# EAGLE design ATTiny2312_ISPProgrammer (EAGLE 6.4)
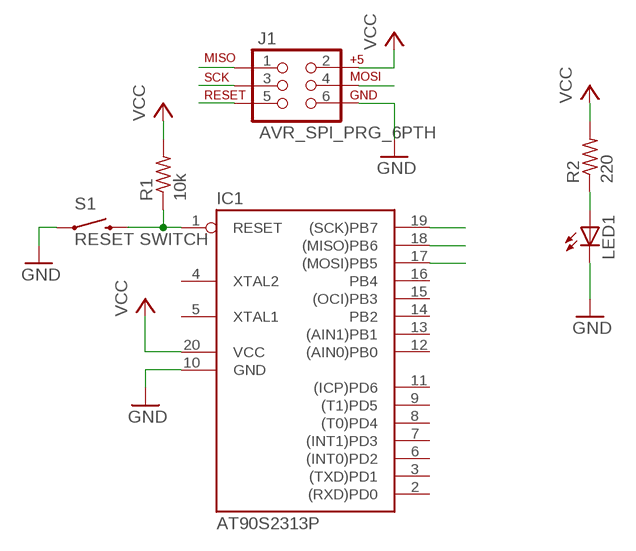
[diagram p0: schematic, sheet 1]

## Parts
IC1  AT90S2313P  [DIL20]
J1  AVR_SPI_PRG_6PTH  [2X3]
LED1  LED-3MM-NO_SILK  [LED3MM-NS]
R1  10k  R-US_0207/10  [0207/10]
R2  220  R-US_0207/10  [0207/10]
S1  RESET SWITCH  SWITCH-MOMENTARY-2PTH  [TACTILE-PTH]

## Nets
GND: IC1.10(GND) J1.6 LED1.K(C) S1.1
MISO: IC1.18((MISO)PB6) J1.1
MOSI: IC1.17((MOSI)PB5) J1.4
N$1: LED1.A R2.1
RST: IC1.1(RESET) J1.5 R1.1 S1.3
SCK: IC1.19((SCK)PB7) J1.3
VCC: IC1.20(VCC) J1.2 R1.2 R2.2
Unconnected: IC1.2((RXD)PD0) IC1.3((TXD)PD1) IC1.4(XTAL2) IC1.5(XTAL1) IC1.6((INT0)PD2) IC1.7((INT1)PD3) IC1.8((T0)PD4) IC1.9((T1)PD5) IC1.11((ICP)PD6) IC1.12((AIN0)PB0) IC1.13((AIN1)PB1) IC1.14(PB2) IC1.15((OCI)PB3) IC1.16(PB4)

## Library data of the parts
IC1 = atmel:AT90S2313: MICROCONTROLLER 2 Kbytes FLASH 128 bytes SRAM 128 bytes EEPROM UART; OC_FARNELL: unknown; OC_NEWARK: unknown
J1 = SparkFun-Connectors:AVR_SPI_PRG_6: AVR ISP 6 Pin This is the reduced ISP connector for AVR programming. Common on Arduino. This footprint will take up less PCB space and can be used with a 10-pin to 6-pin adapter such as SKU: BOB-08508
LED1 = SparkFun-LED:LED: LEDs Standard schematic elements and footprints for 5mm, 3mm, 1206, and 0603 sized LEDs. 5mm - Spark Fun Electronics SKU : COM-00529 (and others)
R1 R2 = rcl:R-US_: RESISTOR, American symbol
S1 = SparkFun-Electromechanical:SWITCH-MOMENTARY-2: Various NO switches- pushbuttons, reed, etc

## Board
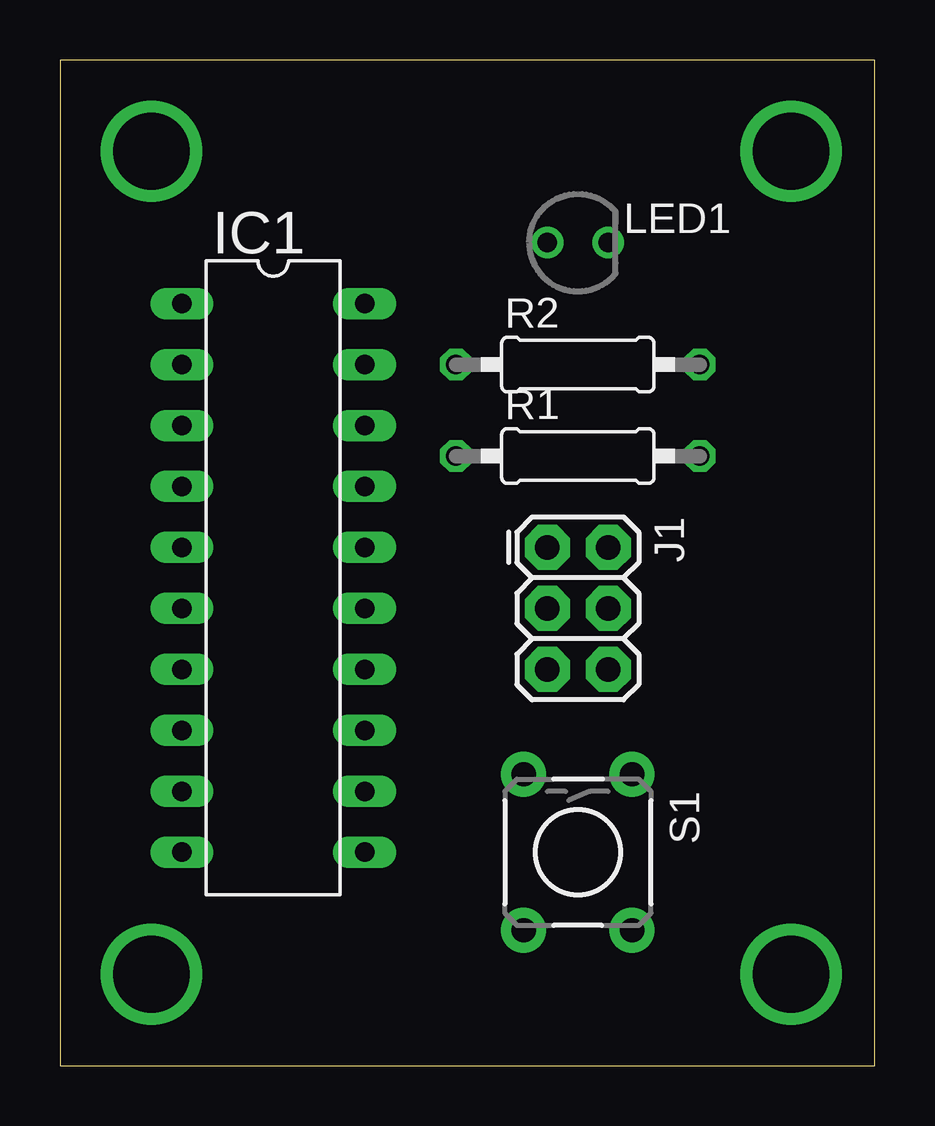
[diagram p1: board, top side]
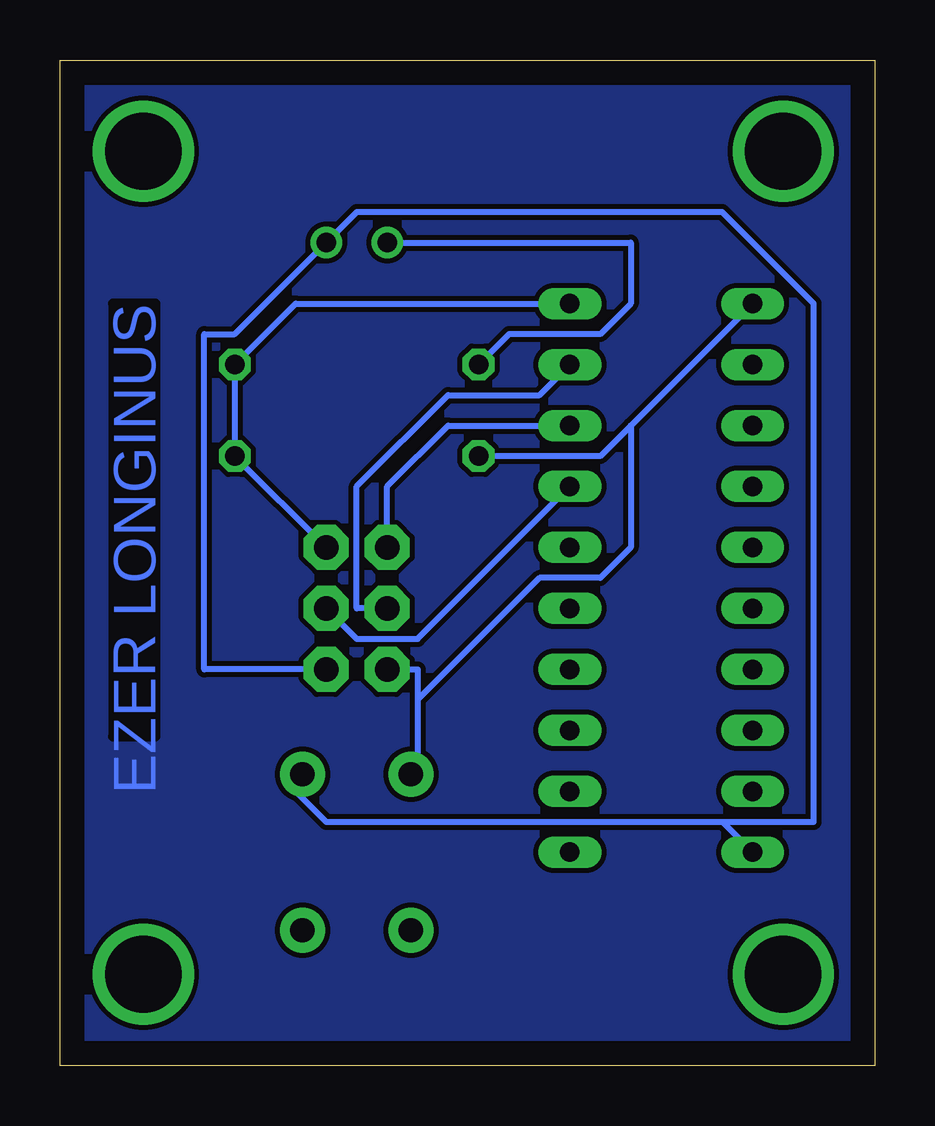
[diagram p2: board, bottom side, seen from below]

Size 33.96 x 41.9 mm. Coordinates in mm from the lower left corner, seen from the top.
Outline: 0,0 33.96,0 33.96,41.9 0,41.9 0,0
Copper layers (1*16): Top 0.035mm / dielectric 1.5mm / Bottom 0.035mm
Design rules "default": minimum track width 10mil, minimum drill 24mil, track to track 8mil, track to pad 8mil, pad to pad 8mil, via to via 8mil, smd to smd 8mil, copper to edge 40mil, drill to drill 8mil, minimum pad ring 10mil, minimum via ring 8mil, stop-mask expansion 4mil, vias tented up to drill 0mil, thermal gap 10mil

### Footprints (pad centres in the part's own frame; a part is rotated, then mirrored left to right if it is on the bottom)
DIL20 = drill 0.813 long: 1 -11.43,-3.81; 2 -8.89,-3.81; 3 -6.35,-3.81; 4 -3.81,-3.81; 5 -1.27,-3.81; 6 1.27,-3.81; 7 3.81,-3.81; 8 6.35,-3.81; 9 8.89,-3.81; 10 11.43,-3.81; 11 11.43,3.81; 12 8.89,3.81; 13 6.35,3.81; 14 3.81,3.81; 15 1.27,3.81; 16 -1.27,3.81; 17 -3.81,3.81; 18 -6.35,3.81; 19 -8.89,3.81; 20 -11.43,3.81
2X3 = drill 1.016 pad 1.88 octagon: 1 0,0; 2 0,2.54; 3 2.54,0; 4 2.54,2.54; 5 5.08,0; 6 5.08,2.54
LED3MM-NS = drill 0.813: A -1.27,0; K 1.27,0
0207/10 = drill 0.813 octagon: 1 -5.08,0; 2 5.08,0
TACTILE-PTH = drill 1.016 pad 1.88: 1 -3.251,2.261; 2 3.251,2.261; 3 -3.251,-2.261; 4 3.251,-2.261

### Placement (x,y rotation side)
IC1  8.89,20.32 270 top
J1  20.32,21.59 270 top
LED1  21.59,34.29 0 top
R1  21.59,25.4 0 top
R2  21.59,29.21 0 top
S1  21.59,8.89 270 top

### Tracks (layer width: path | path; a pad name or v marks a point on that pad's centre or on a via)
GND
  Bottom 0.254: J1.6 27.94,16.51 27.94,30.48 26.67,30.48 LED1.K 21.59,35.56 6.35,35.56 2.54,31.75 2.54,10.16 6.35,10.16 | 6.35,10.16 IC1.10 | 6.35,10.16 22.86,10.16 24.13,11.43 S1.1
MISO
  Bottom 0.254: IC1.18 17.78,26.67 20.32,24.13 J1.1
MOSI
  Bottom 0.254: IC1.17 19.05,17.78 21.59,17.78 J1.4
N$1
  Bottom 0.254: R2.1 15.24,30.48 11.43,30.48 10.16,31.75 10.16,34.29 LED1.A
N$2
  pour Bottom: 0,41.91 34.29,41.91 34.29,0 0,0
N$3  (via drill 3.2)
  other vias: 3.81,3.81
N$4  (via drill 3.2)
  other vias: 3.81,38.1
N$5  (via drill 3.2)
  other vias: 30.48,38.1
N$6  (via drill 3.2)
  other vias: 30.48,3.81
RST
  Bottom 0.254: 19.05,15.24 19.05,16.51 J1.5 | 19.05,15.24 19.05,12.7 S1.3 | R1.1 11.43,25.4 10.16,26.67 | IC1.1 10.16,26.67 | 19.05,15.24 13.97,20.32 11.43,20.32 10.16,21.59 10.16,26.67
SCK
  Bottom 0.254: IC1.19 13.97,27.94 17.78,27.94 21.59,24.13 21.59,19.05 J1.3
VCC
  Bottom 0.254: IC1.20 24.13,31.75 R2.2 R1.2 J1.2

### Text on the board
Bottom: EZER LONGINUS